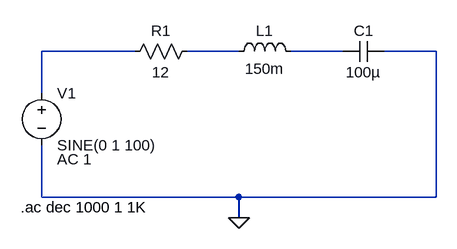
[diagram p0: schematic Series Resonance.asc]
Series Resonance.asc, the LTspice schematic file:
Version 4
SHEET 1 880 680
WIRE 272 208 128 208
WIRE 432 208 352 208
WIRE 592 208 512 208
WIRE 736 208 656 208
WIRE 128 272 128 208
WIRE 128 432 128 352
WIRE 432 432 128 432
WIRE 736 432 736 208
WIRE 736 432 432 432
WIRE 432 464 432 432
FLAG 432 464 0
SYMBOL voltage 128 256 R0
WINDOW 123 24 118 Left 2
SYMATTR Value2 AC 1
SYMATTR InstName V1
SYMATTR Value SINE(0 1 100)
SYMATTR SpiceLine Rser=50
SYMBOL res 368 192 R90
WINDOW 0 0 56 VBottom 2
WINDOW 3 32 56 VTop 2
SYMATTR InstName R1
SYMATTR Value 12
SYMBOL ind 416 224 R270
WINDOW 0 32 56 VTop 2
WINDOW 3 5 56 VBottom 2
SYMATTR InstName L1
SYMATTR Value 150m
SYMBOL cap 592 224 R270
WINDOW 0 32 32 VTop 2
WINDOW 3 0 32 VBottom 2
SYMATTR InstName C1
SYMATTR Value 100µ
TEXT 96 448 Left 2 !.ac dec 1000 1 1K

The netlist it stands for:
* Series Resonance.asc
V1 N001 0 SINE(0 1 100) AC 1 Rser=50
R1 N002 N001 12
L1 N002 N003 150m
C1 N003 0 100µ
.ac dec 1000 1 1K
.backanno
.end